# Altium schematic sheet (4) Controller A20_BUFFERs.SchDoc
size 330 x 241 mm; SheetNumber: 4; SheetTotal: 6
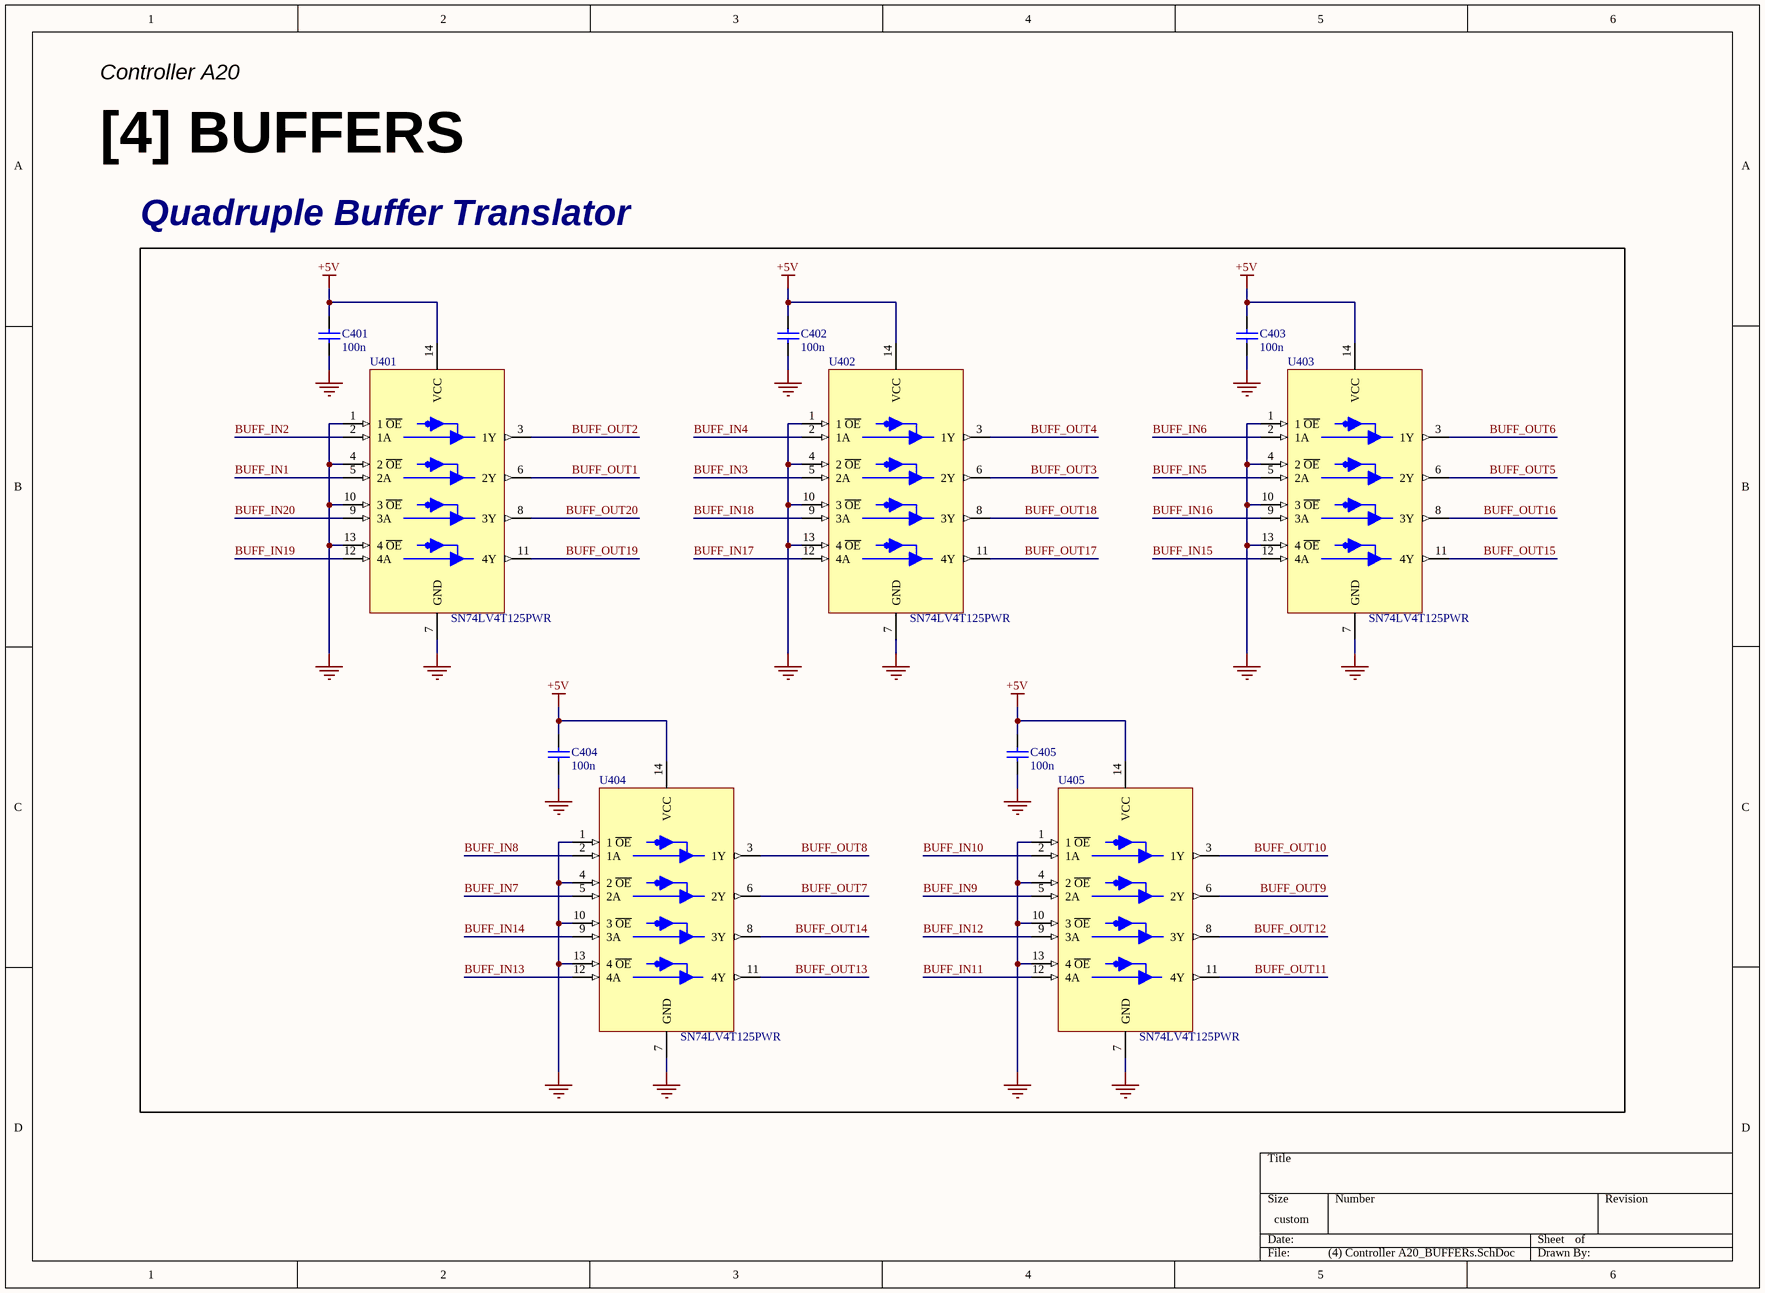
[diagram p0: (4) Controller A20_BUFFERs.SchDoc]

## Parts
C401  100n  [C0603]
C402  100n  [C0603]
C403  100n  [C0603]
C404  100n  [C0603]
C405  100n  [C0603]
U401  SN74LV4T125PWR  [14-TSSOP]
U402  SN74LV4T125PWR  [14-TSSOP]
U403  SN74LV4T125PWR  [14-TSSOP]
U404  SN74LV4T125PWR  [14-TSSOP]
U405  SN74LV4T125PWR  [14-TSSOP]

## Blocks framed on the sheet
Quadruple Buffer Translator: C401-C405 U401-U405

## Nets
+5V: C401.2 C402.2 C403.2 C404.2 C405.2 U401.14(VCC) U402.14(VCC) U403.14(VCC) U404.14(VCC) U405.14(VCC)
GND: C401.1 C402.1 C403.1 C404.1 C405.1 U401.1(1_~{OE}) U401.4(2_~{OE}) U401.7(GND) U401.10(3_~{OE}) U401.13(4_~{OE}) U402.1(1_~{OE}) U402.4(2_~{OE}) U402.7(GND) U402.10(3_~{OE}) U402.13(4_~{OE}) U403.1(1_~{OE}) U403.4(2_~{OE}) U403.7(GND) U403.10(3_~{OE}) U403.13(4_~{OE}) U404.1(1_~{OE}) U404.4(2_~{OE}) U404.7(GND) U404.10(3_~{OE}) U404.13(4_~{OE}) U405.1(1_~{OE}) U405.4(2_~{OE}) U405.7(GND) U405.10(3_~{OE}) U405.13(4_~{OE})
BUFF_IN1: U401.5(2A)
BUFF_IN2: U401.2(1A)
BUFF_IN3: U402.5(2A)
BUFF_IN4: U402.2(1A)
BUFF_IN5: U403.5(2A)
BUFF_IN6: U403.2(1A)
BUFF_IN7: U404.5(2A)
BUFF_IN8: U404.2(1A)
BUFF_IN9: U405.5(2A)
BUFF_IN10: U405.2(1A)
BUFF_IN11: U405.12(4A)
BUFF_IN12: U405.9(3A)
BUFF_IN13: U404.12(4A)
BUFF_IN14: U404.9(3A)
BUFF_IN15: U403.12(4A)
BUFF_IN16: U403.9(3A)
BUFF_IN17: U402.12(4A)
BUFF_IN18: U402.9(3A)
BUFF_IN19: U401.12(4A)
BUFF_IN20: U401.9(3A)
BUFF_OUT1: U401.6(2Y)
BUFF_OUT2: U401.3(1Y)
BUFF_OUT3: U402.6(2Y)
BUFF_OUT4: U402.3(1Y)
BUFF_OUT5: U403.6(2Y)
BUFF_OUT6: U403.3(1Y)
BUFF_OUT7: U404.6(2Y)
BUFF_OUT8: U404.3(1Y)
BUFF_OUT9: U405.6(2Y)
BUFF_OUT10: U405.3(1Y)
BUFF_OUT11: U405.11(4Y)
BUFF_OUT12: U405.8(3Y)
BUFF_OUT13: U404.11(4Y)
BUFF_OUT14: U404.8(3Y)
BUFF_OUT15: U403.11(4Y)
BUFF_OUT16: U403.8(3Y)
BUFF_OUT17: U402.11(4Y)
BUFF_OUT18: U402.8(3Y)
BUFF_OUT19: U401.11(4Y)
BUFF_OUT20: U401.8(3Y)

## Notes on the sheet
- Controller A20
- [4] BUFFERS

## Library data of the parts
C401-C405 = CAP 100nF 50V: 0.1 µF ±10% 50V Ceramic Capacitor X7R 0603 (1608 Metric); Manufacturer: KEMET; Mfr. Part #: C0603C104K5RACTU; Qty.: 10; Ext. Price: 0.11; Supplier: DigiKey; Supplier Part #: 399-C0603C104K5RACTUCT-ND; Package: 0603; Unit Price: 0.011; ComponentLink1Description: Datasheet; ComponentLink1URL: https://www.yageogroup.com/content/datasheet/asset/file/KEM_C1002_X7R_SMD; ComponentLink2Description: Distributor Link; ComponentLink2URL: https://www.digikey.com/en/products/detail/kemet/C0603C104K5RACTU/1465594
U401-U405 = SN74LV4T125PWR Non-Inverting Buffer: Buffer, Non-Inverting 4 Element 1 Bit per Element 3-State Output 14-TSSOP; Manufacturer: Texas Instruments; Qty.: 1; Ext. Price: 0.79; Mfr. Part #: SN74LV4T125PWR; Supplier: DigiKey; Supplier Part #: 296-40545-1-ND; Package: 14-TSSOP; Unit Price: 0.79; ComponentLink1Description: Datasheet; ComponentLink1URL: https://www.ti.com/lit/ds/symlink/sn74lv4t125.pdf?HQS=dis-dk-null-digikeymode-dsf-pf-null-wwe&ts=1762330787956&ref_url=https%253A%252F%252Fwww.ti.com%252Fgeneral%252Fdocs%252Fsuppproductinfo.tsp%253FdistId%253D10%2526gotoUrl%253Dhttps%253A%252F%252Fwww.ti.com%252Flit%252Fgpn%252Fsn74lv4t125; ComponentLink2Description: Distributor Link; ComponentLink2URL: https://www.digikey.com/en/products/detail/texas-instruments/SN74LV4T125PWR/4806529